# Altium schematic sheet TelescopeHeater.SchDoc: Telescope Heater
size A4; DrawnBy: Fabian Hochberg; Organization: KIT; Address1: Elektrotechnisches Institut; Address2: Engelbert-Arnold-Str. 5; Address3: 76131 Karlsruhe; DocumentNumber: 1; Revision: 1.0; SheetNumber: 1; SheetTotal: 1
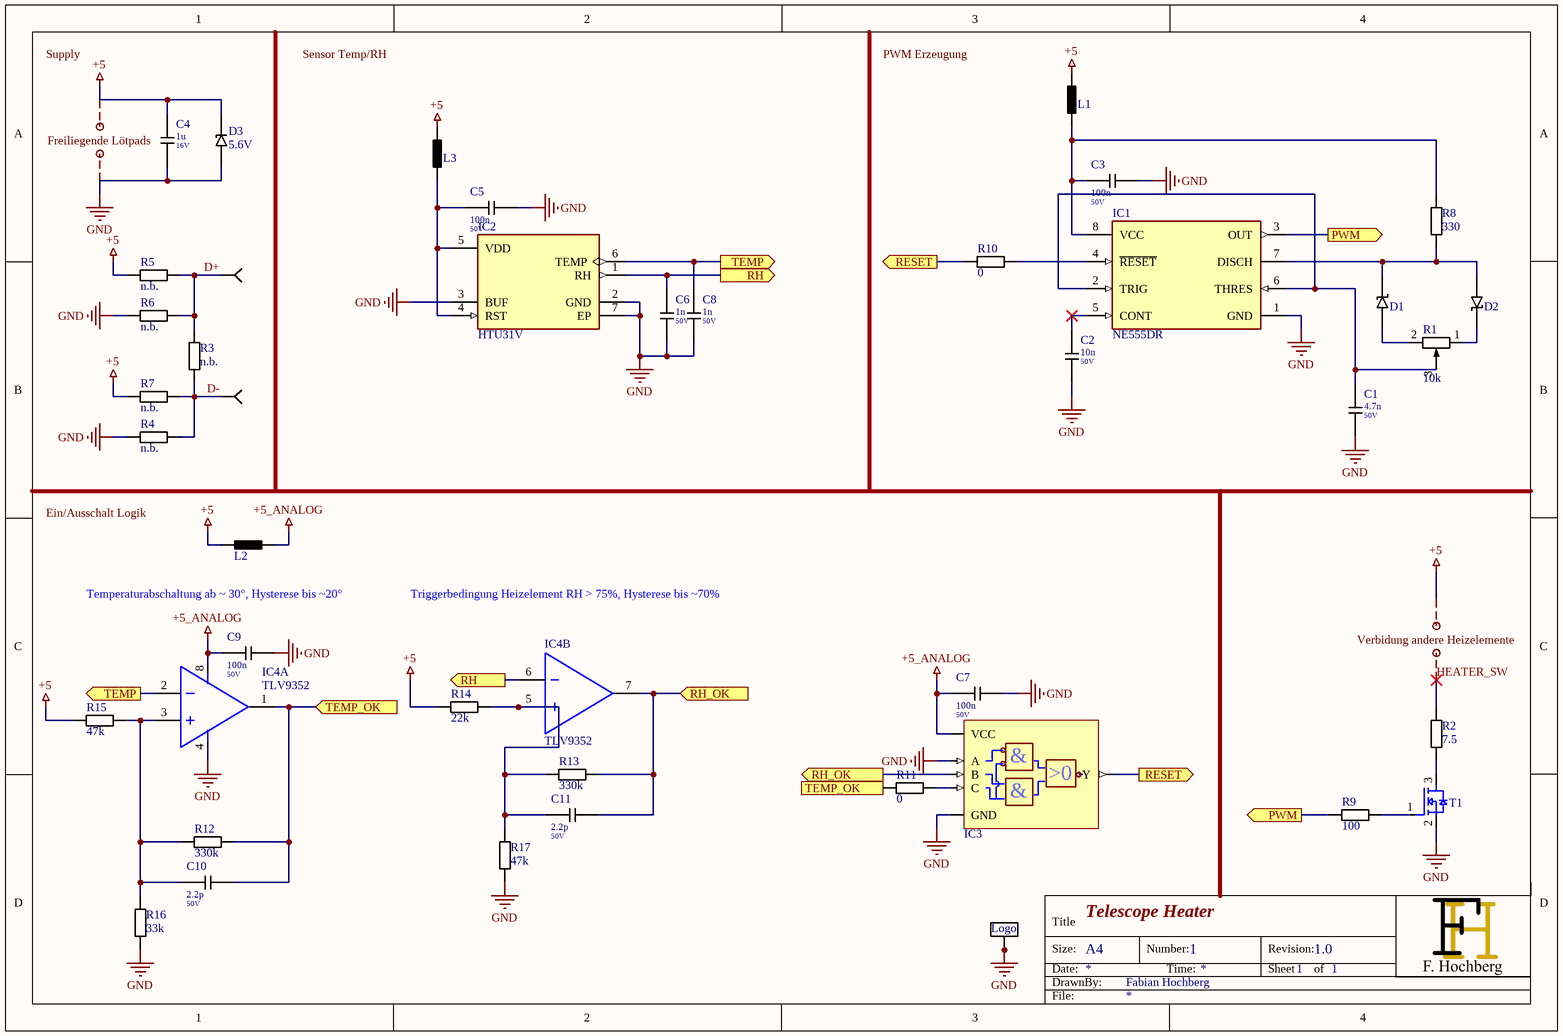
[diagram p0: TelescopeHeater.SchDoc]

## Parts
C1  value 4.7n  Voltage: 50V  [0603_C]  (hidden comment: 4.7n_50V)
C2  value 10n  Voltage: 50V  [0603_C]  (hidden comment: 10n_50V)
C3  value 100n  Voltage: 50V  [0603_C]  (hidden comment: 100n_50V)
C4  value 1u  Voltage: 16V  [0603_C]  (hidden comment: 1u_16V)
C5  value 100n  Voltage: 50V  [0603_C]  (hidden comment: 100n_50V)
C6  value 1n  Voltage: 50V  [0603_C]  (hidden comment: 1n_50V)
C7  value 100n  Voltage: 50V  [0603_C]  (hidden comment: 100n_50V)
C8  value 1n  Voltage: 50V  [0603_C]  (hidden comment: 1n_50V)
C9  value 100n  Voltage: 50V  [0603_C]  (hidden comment: 100n_50V)
C10  value 2.2p  Voltage: 50V  [0603_C]  (hidden comment: 2.2p_50V)
C11  value 2.2p  Voltage: 50V  [0603_C]  (hidden comment: 2.2p_50V)
D1  CUS357  [SOD323]  (value not drawn)
D2  CUS357  [SOD323]  (value not drawn)
D3  5.6V  [MINIMELF-SOD80]
D+  Testpad  [Testpad_1mm]  (value not drawn)
D-  Testpad  [Testpad_1mm]  (value not drawn)
IC1  NE555DR  [FP-D0008A-IPC_A]
IC2  HTU31V  [HTU31D/V-MFG]
IC3  ‎SN74LVC1G58DCKR‎  [SOT-363]  (value not drawn)
IC4  TLV9352  [SOT23-8]  (parts A,B of 2)
L1  100 Ohm @ 100MHz  [0603_L]  (value not drawn)
L2  100 Ohm @ 100MHz  [0603_L]  (value not drawn)
L3  100 Ohm @ 100MHz  [0603_L]  (value not drawn)
Logo_FH1  Logo  [Logo FH]  (value not drawn)
R1  10k  [PIHER_N-6-R_Poti]
R2  7.5  [2512_R]
R3  n.b.  [0603_R]
R4  n.b.  [0603_R]
R5  n.b.  [0603_R]
R6  n.b.  [0603_R]
R7  n.b.  [0603_R]
R8  330  [0603_R]
R9  100  [0603_R]
R10  0  [0603_R]
R11  0  [0603_R]
R12  330k  [0603_R]
R13  330k  [0603_R]
R14  22k  [0603_R]
R15  47k  [0603_R]
R16  33k  [0603_R]
R17  47k  [0603_R]
T1  Si2302CDS  [SOT23-3]  (value not drawn)

## Ports
PWM (out), RESET (out), RH (out), RH_OK (in), RH_OK (out), TEMP (out), TEMP_OK (in), TEMP_OK (out)

## Nets
+5: C4.1 D3.2(K) L1.2 L2.1 L3.2 R5.2 R7.2 R14.1 R15.1
+5_ANALOG: C7.2 C9.2 IC3.5(VCC) IC4.8(V15) L2.2
GND: C1.2 C2.2 C3.1 C4.2 C5.1 C6.2 C7.1 C8.2 C9.1 D3.1(A) IC1.1(GND) IC2.2(GND) IC2.3(BUF) IC2.7(EP) IC3.2(GND) IC3.3(A) IC4.4(GND) Logo_FH1.1 Logo_FH1.2 Logo_FH1.3 Logo_FH1.4 R4.2 R6.2 R16.2 R17.2 T1.2(S)
D+: D+.1(C) R3.1 R5.1 R6.1
D-: D-.1(C) R3.2 R4.1 R7.1
HEATER_SW: R2.2
PWM: IC1.3(OUT) R9.2 ; port PWM
RESET: IC3.4(Y) R10.2 ; port RESET
RH: C6.1 IC2.1(RH) IC4.6 ; port RH
RH_OK: C11.1 IC3.1(B) IC4.7 R13.1 ; port RH_OK
TEMP: C8.1 IC2.6(TEMP) IC4.2 ; port TEMP
TEMP_OK: C10.1 IC4.1 R11.2 R12.1 ; port TEMP_OK
NetC1_1: C1.1 IC1.2(TRIG) IC1.6(THRES) R1.3(S_Wiper)
NetC2_1: C2.1 IC1.5(CONT)
NetC3_2: C3.2 IC1.8(VCC) L1.1 R8.2
NetC5_2: C5.2 IC2.4(RST) IC2.5(VDD) L3.1
NetC10_2: C10.2 IC4.3 R12.2 R15.2 R16.1
NetC11_2: C11.2 IC4.5 R13.2 R14.2 R17.1
NetD1_1: D1.1(A) R1.2(E_Final)
NetD1_2: D1.2(K) D2.1(A) IC1.7(DISCH) R8.1
NetD2_2: D2.2(K) R1.1(A_Initial)
NetIC1_4: IC1.4(~{RESET}) R10.1
NetIC3_6: IC3.6(C) R11.1
NetR2_1: R2.1 T1.3(D)
NetR9_1: R9.1 T1.1(G)

## Notes on the sheet
- Supply
- Sensor Temp/RH
- PWM Erzeugung
- (near C4) Freiliegende Lötpads
- Ein/Ausschalt Logik
- Temperaturabschaltung ab ~ 30°, Hysterese bis ~20°
- Triggerbedingung Heizelement RH > 75%, Hysterese bis ~70%
- Verbidung andere Heizelemente
- Title
- Size:
- Date:
- DrawnBy:
- A4
- Number:
- Time:
- Revision:
- Sheet
- of
- File:
- (in symbol Conf. Logic Gate) &; >0

## Library data of the parts
C1-C11 = C: Keramikkondensator
D1 D2 = Schottky Diode
D3 = Zener Diode: Voltage: 5.6V
IC1 = CMP-1685-00007-2: IC OSC SGL TIMER 100KHZ 8-SOIC; Low Level Output Current: 200mA; Quiescent Current: 15mA; Min Supply Voltage: 4.5V; Number of Timers/Counters: 1; Max Supply Voltage: 16V; Operating Supply Current: 10mA; High Level Output Current: -200mA; Packaging: Tape and Reel; Frequency: 100kHz; Weight: 0.002561oz; REACH SVHC: No SVHC; Package Quantity: 2500; Width: 3.91mm; Max Operating Temperature: 70°C; Contact Plating: Gold; Lead Free: Lead Free; Number of Pins: 8; Min Operating Temperature: 0°C; Radiation Hardening: No; Length: 4.9mm; Case/Package: SOIC; Height: 1.58mm; Mount: Surface Mount
IC2 = HTU31V RH/T: Analog Relative Humidity sensor with Temperature output; Manufacturer Part Number: HTU31D; Manufacturer: TE; Accuracy: 2%; Sensor Output: I2C; Automotive Grade: Grade 1; Standoff Height: 0mm; Min Supply Voltage: 3V; Max Supply Voltage: 5.5V; Operating Supply Current: 450uA; Category: IC; Interface: Analog; Package: 0; RoHS: TRUE; Octopart: https://octopart.com/htu31d-te+connectivity-108994149; Ambient Temperature Range Low: -40°C; Temperature Range High: +125°C; Temperature Range Low: -40°C; Ipc Land Pattern Name: DFN250X250X100-6; Device Class L1: Sensors; Lead Free: Yes; Height: 1mm; ComponentLink2Description: Datasheet; Ambient Temperature Range High: +125°C; Device Class L2: Temperature and Humidity Sensors; ComponentLink2URL: https://www.te.com/commerce/DocumentDelivery/DDEController?Action=showdoc&DocId=Data+Sheet%7FHTU31D-RHT-SENSOR-IC-DIGITAL%7FA1%7Fpdf%7FEnglish%7FENG_DS_HTU31D-RHT-SENSOR-IC-DIGITAL_A1.pdf%7F10142020-00; Temperature: -40°C to +125°C; Automotive: Yes; Device Class L3: unset
IC3 = Conf. Logic Gate: Low-power configurable multiple function gate
IC4 = Dual OP Amp: OP / Comparator
L1-L3 = L: 0,15 Ohm 1A max / 100 Ohm @ 100MHz; EBS_Nummer: 10111; HelpURL: https://ebs.eti.kit.edu/Artikel/Detailansicht/10111
Logo_FH1 = Logo: 8x8 mm Logo Fabian Hochberg
R1 = Poti: value: 10k
R2-R17 = R
  R2: Value: 7.5
  R3-R7: Value: n.b.
  R8: Value: 330
  R9: Value: 100
  R10 R11: Value: 0
  R12 R13: Value: 330k
  R14: Value: 22k
  R15 R17: Value: 47k
  R16: Value: 33k
T1 = Signal N-MOSFET: N-Channel 20-V (D-S) MOSFET